# Altium project Game_TEAD_Aliens_64A-2.PrjPcb
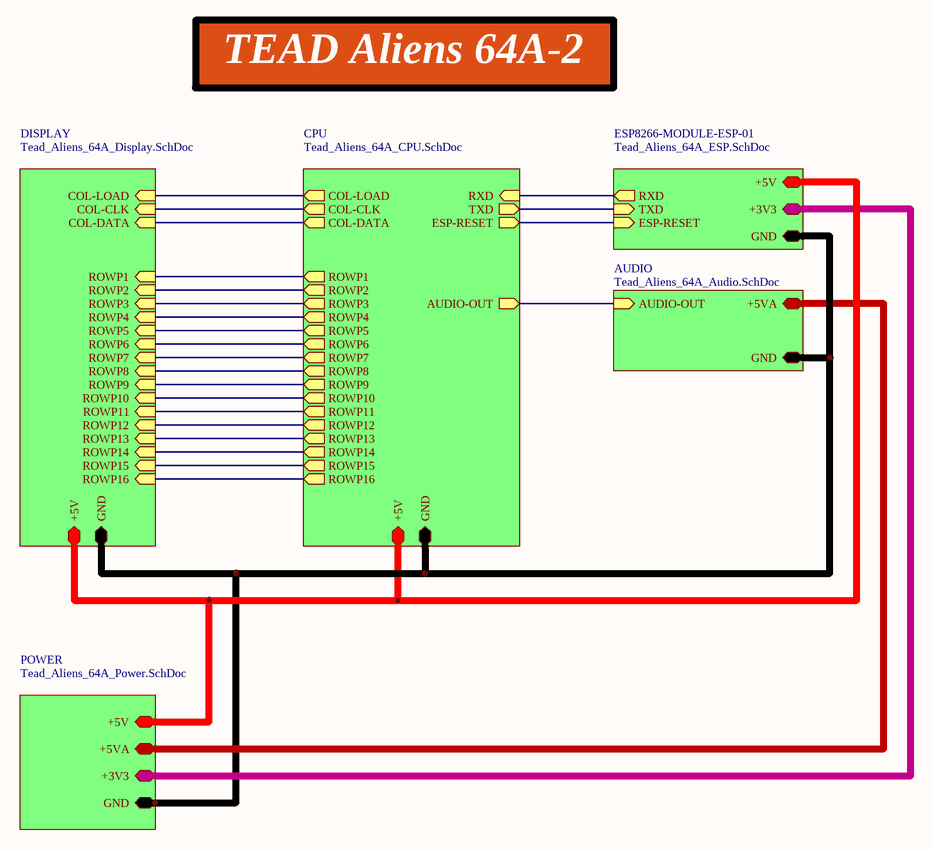
[diagram p0: Tead_Aliens_64A_Main.SchDoc]
6 sheets, 94 parts. Net scope: hierarchical (ports join the sheet entries above them; power ports are global).
Board file: Tead_Aliens_64A.PcbDoc
Sheets:
  Tead_Aliens_64A_Main.SchDoc
    DISPLAY = Tead_Aliens_64A_Display.SchDoc
    CPU = Tead_Aliens_64A_CPU.SchDoc
    ESP8266-MODULE-ESP-01 = Tead_Aliens_64A_ESP.SchDoc
    AUDIO = Tead_Aliens_64A_Audio.SchDoc
    POWER = Tead_Aliens_64A_Power.SchDoc

## Sheet Tead_Aliens_64A_Main.SchDoc: Tead Aliens on ATMega64A(Main)
size A4; Date: 21/01/2021; ApprovedBy: NeperMath; CheckedBy: NeperMath; Author: NeperMath; DrawnBy: NeperMath; Engineer: NeperMath; Address1: Tead Alien Clock; Address2: on ATMega64A; Address3: AVR Risc microcontroller; Address4: displays (8x8) 3x2; DocumentNumber: 1; Revision: 1; SheetNumber: 1; SheetTotal: 1; CurrentTime: 00:57; CurrentDate: 21/01/2021; Time: 00:56

### Sub-sheets
AUDIO = Tead_Aliens_64A_Audio.SchDoc: AUDIO-OUT (in), GND, +5VA
CPU = Tead_Aliens_64A_CPU.SchDoc: COL-LOAD (out), COL-CLK (out), COL-DATA (out), ROWP1 (out), ROWP2 (out), ROWP3 (out), ROWP4 (out), ROWP5 (out), ROWP6 (out), ROWP8 (out), ROWP9 (out), ROWP10 (out), ROWP11 (out), ROWP12 (out), ROWP13 (out), ROWP14 (out), ROWP15 (out), ROWP16 (out), RXD (in), TXD (out), AUDIO-OUT (out), ESP-RESET (out), +5V, GND, ROWP7 (out)
DISPLAY = Tead_Aliens_64A_Display.SchDoc: COL-LOAD (in), COL-CLK (in), COL-DATA (in), ROWP1 (in), ROWP2 (in), ROWP3 (in), ROWP4 (in), ROWP5 (in), ROWP6 (in), ROWP7 (in), ROWP8 (in), ROWP9 (in), ROWP10 (in), ROWP11 (in), ROWP12 (in), ROWP13 (in), ROWP14 (in), ROWP15 (in), ROWP16 (in), +5V, GND
ESP8266-MODULE-ESP-01 = Tead_Aliens_64A_ESP.SchDoc: RXD (out), TXD (in), ESP-RESET (in), +5V, +3V3, GND
POWER = Tead_Aliens_64A_Power.SchDoc: +5V, +5VA, +3V3, GND

### Nets
AIN: sheet CPU/AUDIO-OUT, sheet AUDIO/AUDIO-OUT
COL-C: sheet DISPLAY/COL-CLK, sheet CPU/COL-CLK
COL-D-1-8: sheet DISPLAY/COL-DATA, sheet CPU/COL-DATA
COL-L: sheet DISPLAY/COL-LOAD, sheet CPU/COL-LOAD
ESP-RES: sheet CPU/ESP-RESET, sheet ESP8266-MODULE-ESP-01/ESP-RESET
ROWR1: sheet DISPLAY/ROWP1, sheet CPU/ROWP1
ROWR2: sheet DISPLAY/ROWP2, sheet CPU/ROWP2
ROWR3: sheet DISPLAY/ROWP3, sheet CPU/ROWP3
ROWR4: sheet DISPLAY/ROWP4, sheet CPU/ROWP4
ROWR5: sheet DISPLAY/ROWP5, sheet CPU/ROWP5
ROWR6: sheet DISPLAY/ROWP6, sheet CPU/ROWP6
ROWR7: sheet DISPLAY/ROWP7, sheet CPU/ROWP7
ROWR8: sheet DISPLAY/ROWP8, sheet CPU/ROWP8
ROWR9: sheet DISPLAY/ROWP9, sheet CPU/ROWP9
ROWR10: sheet DISPLAY/ROWP10, sheet CPU/ROWP10
ROWR11: sheet DISPLAY/ROWP11, sheet CPU/ROWP11
ROWR12: sheet DISPLAY/ROWP12, sheet CPU/ROWP12
ROWR13: sheet DISPLAY/ROWP13, sheet CPU/ROWP13
ROWR14: sheet DISPLAY/ROWP14, sheet CPU/ROWP14
ROWR15: sheet DISPLAY/ROWP15, sheet CPU/ROWP15
ROWR16: sheet DISPLAY/ROWP16, sheet CPU/ROWP16
RX: sheet CPU/RXD, sheet ESP8266-MODULE-ESP-01/RXD
TX: sheet CPU/TXD, sheet ESP8266-MODULE-ESP-01/TXD
(unnamed): sheet DISPLAY/+5V, sheet CPU/+5V, sheet ESP8266-MODULE-ESP-01/+5V, sheet POWER/+5V
(unnamed): sheet DISPLAY/GND, sheet CPU/GND, sheet ESP8266-MODULE-ESP-01/GND, sheet AUDIO/GND, sheet POWER/GND
(unnamed): sheet ESP8266-MODULE-ESP-01/+3V3, sheet POWER/+3V3
(unnamed): sheet AUDIO/+5VA, sheet POWER/+5VA

### Notes on the sheet
- TEAD Aliens 64A-2
- Title
- Size:
- Date:
- A4
- Number:
- Time:
- Revision:
- Sheet
- of
- File:

## Sheet Tead_Aliens_64A_Display.SchDoc: Tead Aliens 64A Display
size A4; Date: 23/01/2021; CheckedBy: Nepermath; Author: Nepermath; DrawnBy: Nepermath; Engineer: Nepermath; DocumentNumber: Nepermath; Revision: 1; SheetNumber: 1; SheetTotal: 1; CurrentTime: 14:51; CurrentDate: 23/01/2021; Time: 23:01
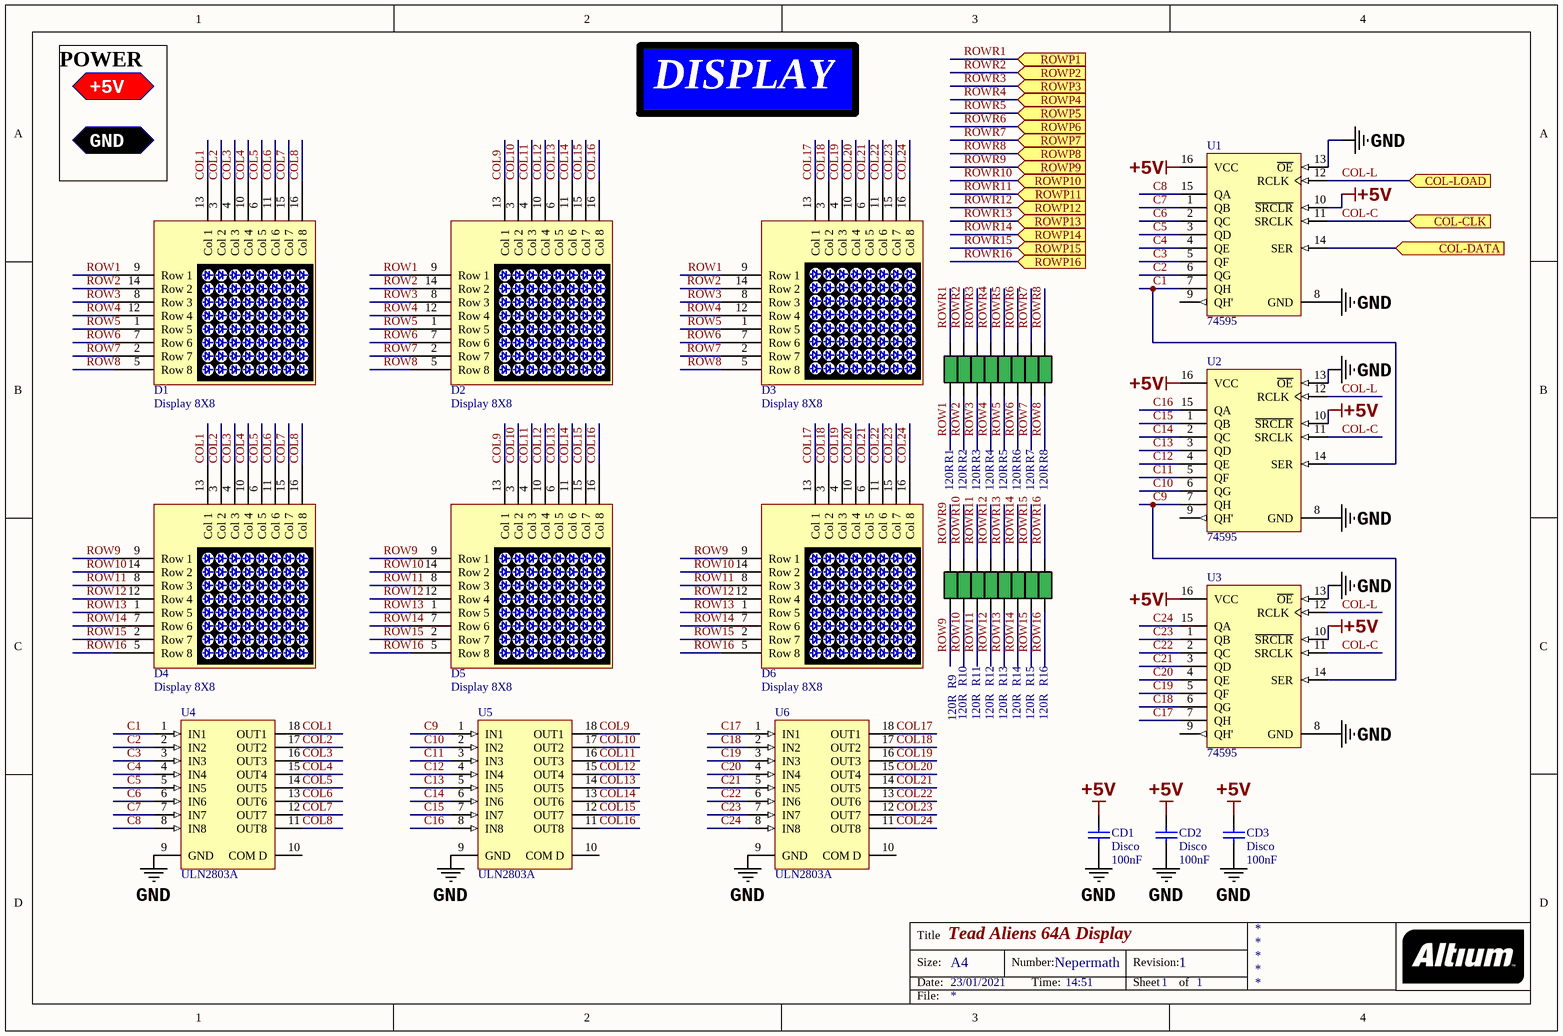
[diagram p1: Tead_Aliens_64A_Display.SchDoc]

### Parts
CD1  Disco  value 100nF  [CAP CER DISK 3MM]
CD2  Disco  value 100nF  [CAP CER DISK 3MM]
CD3  Disco  value 100nF  [CAP CER DISK 3MM]
D1  Display 8X8  [DISPLAY_2088BS_DIP_2X8]
D2  Display 8X8  [DISPLAY_2088BS_DIP_2X8]
D3  Display 8X8  [DISPLAY_2088BS_DIP_2X8]
D4  Display 8X8  [DISPLAY_2088BS_DIP_2X8]
D5  Display 8X8  [DISPLAY_2088BS_DIP_2X8]
D6  Display 8X8  [DISPLAY_2088BS_DIP_2X8]
R1  value 120R  [RES_0805]  (hidden comment: Resistor Generic)
R2  value 120R  [RES_0805]  (hidden comment: Resistor Generic)
R3  value 120R  [RES_0805]  (hidden comment: Resistor Generic)
R4  value 120R  [RES_0805]  (hidden comment: Resistor Generic)
R5  value 120R  [RES_0805]  (hidden comment: Resistor Generic)
R6  value 120R  [RES_0805]  (hidden comment: Resistor Generic)
R7  value 120R  [RES_0805]  (hidden comment: Resistor Generic)
R8  value 120R  [RES_0805]  (hidden comment: Resistor Generic)
R9  value 120R  [RES_0805]  (hidden comment: Resistor Generic)
R10  value 120R  [RES_0805]  (hidden comment: Resistor Generic)
R11  value 120R  [RES_0805]  (hidden comment: Resistor Generic)
R12  value 120R  [RES_0805]  (hidden comment: Resistor Generic)
R13  value 120R  [RES_0805]  (hidden comment: Resistor Generic)
R14  value 120R  [RES_0805]  (hidden comment: Resistor Generic)
R15  value 120R  [RES_0805]  (hidden comment: Resistor Generic)
R16  value 120R  [RES_0805]  (hidden comment: Resistor Generic)
U1  74595  [DIP16]
U2  74595  [DIP16]
U3  74595  [DIP16]
U4  ULN2803A  [DIP18]
U5  ULN2803A  [DIP18]
U6  ULN2803A  [DIP18]

### Ports
+5V, COL-CLK (in), COL-DATA (in), COL-LOAD (in), GND, ROWP1 (in), ROWP2 (in), ROWP3 (in), ROWP4 (in), ROWP5 (in), ROWP6 (in), ROWP7 (in), ROWP8 (in), ROWP9 (in), ROWP10 (in), ROWP11 (in), ROWP12 (in), ROWP13 (in), ROWP14 (in), ROWP15 (in), ROWP16 (in)

### Nets
+5V: CD1.1 CD2.1 CD3.1 U1.10(~{SRCLR}) U1.16(VCC) U2.10(~{SRCLR}) U2.16(VCC) U3.10(~{SRCLR}) U3.16(VCC)
GND: CD1.2 CD2.2 CD3.2 U1.8(GND) U1.13(~{OE}) U2.8(GND) U2.13(~{OE}) U3.8(GND) U3.13(~{OE}) U4.9(GND) U5.9(GND) U6.9(GND)
C1: U1.7(QH) U2.14(SER) U4.1(IN1)
C2: U1.6(QG) U4.2(IN2)
C3: U1.5(QF) U4.3(IN3)
C4: U1.4(QE) U4.4(IN4)
C5: U1.3(QD) U4.5(IN5)
C6: U1.2(QC) U4.6(IN6)
C7: U1.1(QB) U4.7(IN7)
C8: U1.15(QA) U4.8(IN8)
C9: U2.7(QH) U3.14(SER) U5.1(IN1)
C10: U2.6(QG) U5.2(IN2)
C11: U2.5(QF) U5.3(IN3)
C12: U2.4(QE) U5.4(IN4)
C13: U2.3(QD) U5.5(IN5)
C14: U2.2(QC) U5.6(IN6)
C15: U2.1(QB) U5.7(IN7)
C16: U2.15(QA) U5.8(IN8)
C17: U3.7(QH) U6.1(IN1)
C18: U3.6(QG) U6.2(IN2)
C19: U3.5(QF) U6.3(IN3)
C20: U3.4(QE) U6.4(IN4)
C21: U3.3(QD) U6.5(IN5)
C22: U3.2(QC) U6.6(IN6)
C23: U3.1(QB) U6.7(IN7)
C24: U3.15(QA) U6.8(IN8)
COL1: D1.13(Col_1) D4.13(Col_1) U4.18(OUT1)
COL2: D1.3(Col_2) D4.3(Col_2) U4.17(OUT2)
COL3: D1.4(Col_3) D4.4(Col_3) U4.16(OUT3)
COL4: D1.10(Col_4) D4.10(Col_4) U4.15(OUT4)
COL5: D1.6(Col_5) D4.6(Col_5) U4.14(OUT5)
COL6: D1.11(Col_6) D4.11(Col_6) U4.13(OUT6)
COL7: D1.15(Col_7) D4.15(Col_7) U4.12(OUT7)
COL8: D1.16(Col_8) D4.16(Col_8) U4.11(OUT8)
COL9: D2.13(Col_1) D5.13(Col_1) U5.18(OUT1)
COL10: D2.3(Col_2) D5.3(Col_2) U5.17(OUT2)
COL11: D2.4(Col_3) D5.4(Col_3) U5.16(OUT3)
COL12: D2.10(Col_4) D5.10(Col_4) U5.15(OUT4)
COL13: D2.6(Col_5) D5.6(Col_5) U5.14(OUT5)
COL14: D2.11(Col_6) D5.11(Col_6) U5.13(OUT6)
COL15: D2.15(Col_7) D5.15(Col_7) U5.12(OUT7)
COL16: D2.16(Col_8) D5.16(Col_8) U5.11(OUT8)
COL17: D3.13(Col_1) D6.13(Col_1) U6.18(OUT1)
COL18: D3.3(Col_2) D6.3(Col_2) U6.17(OUT2)
COL19: D3.4(Col_3) D6.4(Col_3) U6.16(OUT3)
COL20: D3.10(Col_4) D6.10(Col_4) U6.15(OUT4)
COL21: D3.6(Col_5) D6.6(Col_5) U6.14(OUT5)
COL22: D3.11(Col_6) D6.11(Col_6) U6.13(OUT6)
COL23: D3.15(Col_7) D6.15(Col_7) U6.12(OUT7)
COL24: D3.16(Col_8) D6.16(Col_8) U6.11(OUT8)
COL-C: U1.11(SRCLK) U2.11(SRCLK) U3.11(SRCLK) ; port COL-CLK
COL-D-1-8: U1.14(SER) ; port COL-DATA
COL-L: U1.12(RCLK) U2.12(RCLK) U3.12(RCLK) ; port COL-LOAD
ROW1: D1.9(Row_1) D2.9(Row_1) D3.9(Row_1) R1.1
ROW2: D1.14(Row_2) D2.14(Row_2) D3.14(Row_2) R2.1
ROW3: D1.8(Row_3) D2.8(Row_3) D3.8(Row_3) R3.1
ROW4: D1.12(Row_4) D2.12(Row_4) D3.12(Row_4) R4.1
ROW5: D1.1(Row_5) D2.1(Row_5) D3.1(Row_5) R5.1
ROW6: D1.7(Row_6) D2.7(Row_6) D3.7(Row_6) R6.1
ROW7: D1.2(Row_7) D2.2(Row_7) D3.2(Row_7) R7.1
ROW8: D1.5(Row_8) D2.5(Row_8) D3.5(Row_8) R8.1
ROW9: D4.9(Row_1) D5.9(Row_1) D6.9(Row_1) R9.1
ROW10: D4.14(Row_2) D5.14(Row_2) D6.14(Row_2) R10.1
ROW11: D4.8(Row_3) D5.8(Row_3) D6.8(Row_3) R11.1
ROW12: D4.12(Row_4) D5.12(Row_4) D6.12(Row_4) R12.1
ROW13: D4.1(Row_5) D5.1(Row_5) D6.1(Row_5) R13.1
ROW14: D4.7(Row_6) D5.7(Row_6) D6.7(Row_6) R14.1
ROW15: D4.2(Row_7) D5.2(Row_7) D6.2(Row_7) R15.1
ROW16: D4.5(Row_8) D5.5(Row_8) D6.5(Row_8) R16.1
ROWR1: R1.2 ; port ROWP1
ROWR2: R2.2 ; port ROWP2
ROWR3: R3.2 ; port ROWP3
ROWR4: R4.2 ; port ROWP4
ROWR5: R5.2 ; port ROWP5
ROWR6: R6.2 ; port ROWP6
ROWR7: R7.2 ; port ROWP7
ROWR8: R8.2 ; port ROWP8
ROWR9: R9.2 ; port ROWP9
ROWR10: R10.2 ; port ROWP10
ROWR11: R11.2 ; port ROWP11
ROWR12: R12.2 ; port ROWP12
ROWR13: R13.2 ; port ROWP13
ROWR14: R14.2 ; port ROWP14
ROWR15: R15.2 ; port ROWP15
ROWR16: R16.2 ; port ROWP16

Not connected (* = marked no-connect by the designer): U1 9(QH'); U2 9(QH'); U3 9(QH'); U4 10(COM_D); U5 10(COM_D); U6 10(COM_D)

### Notes on the sheet
- DISPLAY
- (near D1) POWER
- Title
- Size:
- Date:
- A4
- Number:
- Time:
- Revision:
- Sheet
- of
- File:

### Library data of the parts
CD1-CD3 = CAP_DISCO: SMD Capacitor 1210 size
D1-D6 = Display 2088BS 8x8 60mm X 60 mm: Display Dot LED 8x8  60mm X 60 mm
R1-R16 = Resistor Generic: Generic Resistor
U1-U3 = 74595 Generico L,H,HC,F,LS: 74595 Generico L,H,LC,HC,F,LS
U4-U6 = ULN2803A: Eight Darlington Array; Published: 8-Jun-2000; LatestRevisionDate: 06-Jun-2005; LatestRevisionNote: Stylized 3D Model Added.; DatasheetVersion: Sep-1997; PackageReference: DIP18; Publisher: Altium Limited; PackageDescription: DIP; 18 Leads; Row Spacing 7.62 mm; Pitch 2.54 mm; ComponentLink1Description: Manufacturer Link; ComponentLink1URL: http://www.st.com/; ComponentLink2Description: Datasheet; ComponentLink2URL: http://www.st.com/stonline/products/literature/ds/1536/uln2801a.pdf

## Sheet Tead_Aliens_64A_CPU.SchDoc: Tead Aliens 64A CPU
size A4; Date: 23/01/2021; ApprovedBy: NeperMath; CheckedBy: NeperMath; Author: NeperMath; DrawnBy: NeperMath; Engineer: NeperMath; DocumentNumber: 1; Revision: 1; SheetNumber: 1; SheetTotal: 1; CurrentTime: 15:44; CurrentDate: 23/01/2021; Time: 15:44
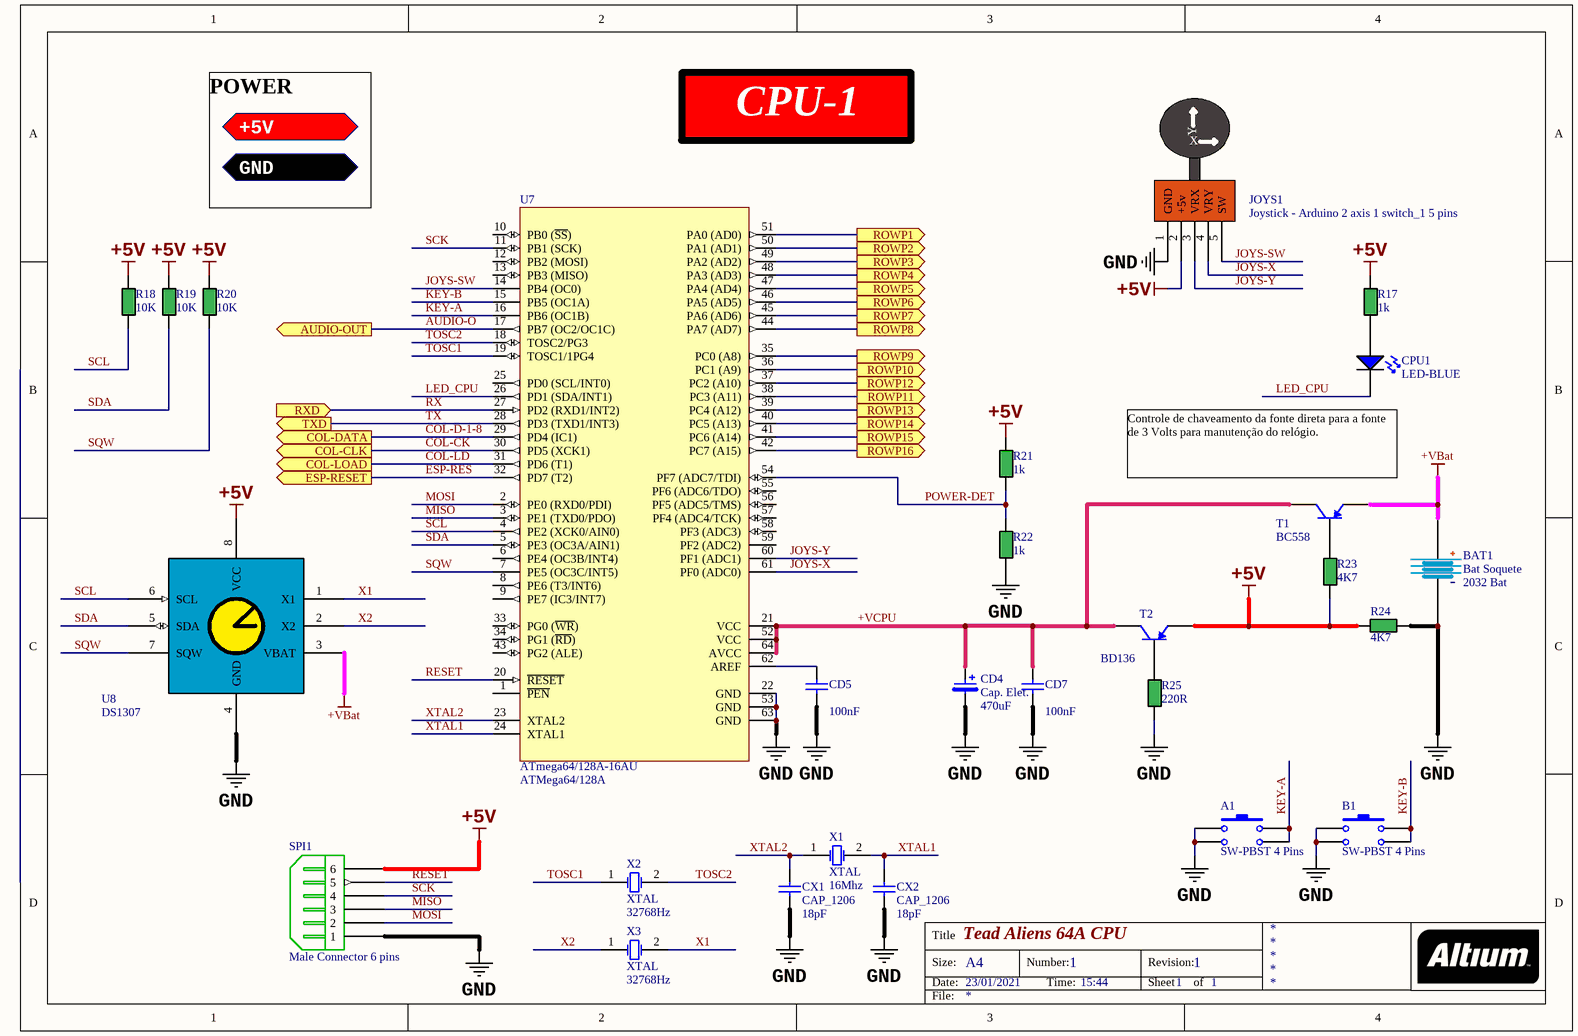
[diagram p2: Tead_Aliens_64A_CPU.SchDoc]

### Parts
A1  SW-PBST 4 Pins  [SW-PBST 4 PINS - B3F]
B1  SW-PBST 4 Pins  [SW-PBST 4 PINS - B3F]
BAT1  Bat Soquete  value 2032 Bat  [Batt Sup CR2025]
CD4  Cap. Elet.  value 470uF  [CAP ELE RAD 11mm H]
CD5  value 100nF  [CAP_1206]  (hidden comment: CAP_1206)
CD7  value 100nF  [CAP_1206]  (hidden comment: CAP_1206)
CPU1  LED-BLUE  [LED BLUE 3MM]
CX1  CAP_1206  value 18pF  [CAP_1206]
CX2  CAP_1206  value 18pF  [CAP_1206]
JOYS1  Joystick - Arduino 2 axis 1 switch_1 5 pins  [JOYSTICK ARDUINO 5 PINS 0 GRAUS]
R17  value 1k  [RES_0805]  (hidden comment: Resistor Generic)
R18  value 10K  [RES_0805]  (hidden comment: Resistor Generic)
R19  value 10K  [RES_0805]  (hidden comment: Resistor Generic)
R20  value 10K  [RES_0805]  (hidden comment: Resistor Generic)
R21  value 1k  [RES_0805]  (hidden comment: Resistor Generic)
R22  value 1k  [RES_0805]  (hidden comment: Resistor Generic)
R23  value 4K7  [RES_0805]  (hidden comment: Resistor Generic)
R24  value 4K7  [RES_0805]  (hidden comment: Resistor Generic)
R25  value 220R  [RES 300 CR25]  (hidden comment: Resistor Generic)
SPI1  Male Connector 6 pins  [BPSC-6]
T1  value BC558  [TO-92 - BIG]  (hidden comment: Transistor)
T2  value BD136  [TO126]  (hidden comment: Transistor)
U7  ATmega64/128A-16AU  value ATMega64/128A  [64A_L]
U8  DS1307  [DIP8]
X1  XTAL  value 16Mhz  [XTAL HC49-4H]
X2  XTAL  value 32768Hz  [XTAL CILINDRIC DEITADO]
X3  XTAL  value 32768Hz  [XTAL CILINDRIC DEITADO]

### Ports
+5V, AUDIO-OUT (out), COL-CLK (out), COL-DATA (out), COL-LOAD (out), ESP-RESET (out), GND, ROWP1 (out), ROWP2 (out), ROWP3 (out), ROWP4 (out), ROWP5 (out), ROWP6 (out), ROWP7 (out), ROWP8 (out), ROWP9 (out), ROWP10 (out), ROWP11 (out), ROWP12 (out), ROWP13 (out), ROWP14 (out), ROWP15 (out), ROWP16 (out), RXD (in), TXD (out)

### Nets
+5V: JOYS1.2(+5v) R17.2 R18.2 R19.2 R20.2 R21.2 R23.1 R24.2 SPI1.6 T2.1(E) U8.8(VCC)
+VBat: BAT1.1 T1.1(E) U8.3(VBAT)
GND: A1.1 A1.2 B1.1 B1.2 BAT1.2 CD4.2 CD5.1 CD7.1 CX1.1 CX2.1 JOYS1.1(GND) R22.1 R24.1 R25.1 SPI1.1 U7.22(GND) U7.53(GND) U7.63(GND) U8.4(GND)
+VCPU: CD4.1 CD7.2 T1.3(C) T2.3(C) U7.21(VCC) U7.52(VCC) U7.64(AVCC)
AUDIO-O: U7.17(PB7_(OC2/OC1C)) ; port AUDIO-OUT  [project net AIN]
COL-CK: U7.30(PD5_(XCK1)) ; port COL-CLK  [project net COL-C]
COL-D-1-8: U7.29(PD4_(IC1)) ; port COL-DATA
COL-LD: U7.31(PD6_(T1)) ; port COL-LOAD  [project net COL-L]
ESP-RES: U7.32(PD7_(T2)) ; port ESP-RESET
JOYS-SW: JOYS1.5(SW) U7.14(PB4_(OC0))
JOYS-X: JOYS1.4(VRY) U7.61(PF0_(ADC0))
JOYS-Y: JOYS1.3(VRX) U7.60(PF1_(ADC1))
KEY-A: A1.3 A1.4 U7.16(PB6_(OC1B))
KEY-B: B1.3 B1.4 U7.15(PB5_(OC1A))
LED_CPU: CPU1.K U7.26(PD1_(SDA/INT1))
MISO: SPI1.3 U7.3(PE1_(TXD0/PDO))
MOSI: SPI1.2 U7.2(PE0_(RXD0/PDI))
POWER-DET: R21.1 R22.2 U7.54(PF7_(ADC7/TDI))
RESET: SPI1.5 U7.20(~{RESET})
ROWR1: U7.51(PA0_(AD0)) ; port ROWP1
ROWR2: U7.50(PA1_(AD1)) ; port ROWP2
ROWR3: U7.49(PA2_(AD2)) ; port ROWP3
ROWR4: U7.48(PA3_(AD3)) ; port ROWP4
ROWR5: U7.47(PA4_(AD4)) ; port ROWP5
ROWR6: U7.46(PA5_(AD5)) ; port ROWP6
ROWR7: U7.45(PA6_(AD6)) ; port ROWP7
ROWR8: U7.44(PA7_(AD7)) ; port ROWP8
ROWR9: U7.35(PC0_(A8)) ; port ROWP9
ROWR10: U7.36(PC1_(A9)) ; port ROWP10
ROWR11: U7.38(PC3_(A11)) ; port ROWP11
ROWR12: U7.37(PC2_(A10)) ; port ROWP12
ROWR13: U7.39(PC4_(A12)) ; port ROWP13
ROWR14: U7.40(PC5_(A13)) ; port ROWP14
ROWR15: U7.41(PC6_(A14)) ; port ROWP15
ROWR16: U7.42(PC7_(A15)) ; port ROWP16
RX: U7.27(PD2_(RXD1/INT2)) ; port RXD
SCK: SPI1.4 U7.11(PB1_(SCK))
SCL: R18.1 U7.4(PE2_(XCK0/AIN0)) U8.6(SCL)
SDA: R19.1 U7.5(PE3_(OC3A/AIN1)) U8.5(SDA)
SQW: R20.1 U7.7(PE5_(OC3C/INT5)) U8.7(SQW)
TOSC1: U7.19(TOSC1/1PG4) X2.1(OSC1)
TOSC2: U7.18(TOSC2/PG3) X2.2(OSC2)
TX: U7.28(PD3_(TXD1/INT3)) ; port TXD
X1: U8.1(X1) X3.2(OSC2)
X2: U8.2(X2) X3.1(OSC1)
XTAL1: CX2.2 U7.24(XTAL1) X1.2(OSC2)
XTAL2: CX1.2 U7.23(XTAL2) X1.1(OSC1)
NetCD5_2: CD5.2 U7.62(AREF)
NetCPU1_A: CPU1.A R17.1
NetR23_2: R23.2 T1.2(B)
NetR25_2: R25.2 T2.2(B)

Not connected (* = marked no-connect by the designer): U7 1(~{PEN}) 6(PE4_(OC3B/INT4)) 8(PE6_(T3/INT6)) 9(PE7_(IC3/INT7)) 10(PB0_(~{SS})) 12(PB2_(MOSI)) 13(PB3_(MISO)) 25(PD0_(SCL/INT0)) 33(PG0_(~{WR})) 34(PG1_(~{RD})) 43(PG2_(ALE)) 55(PF6_(ADC6/TDO)) 56(PF5_(ADC5/TMS)) 57(PF4_(ADC4/TCK)) 58(PF3_(ADC3)) 59(PF2_(ADC2))

### Notes on the sheet
- CPU-1
- POWER
- Controle de chaveamento da fonte direta para a fonte de 3 Volts para manutenção do relógio.
- Title
- Size:
- Date:
- A4
- Number:
- Time:
- Revision:
- Sheet
- of
- File:
- (in symbol Joystick - Arduino 2 axis 1 switch_1 5 pins) Y; X

### Library data of the parts
A1 B1 = SW-PBST 4 Pins SKHH: Published: 24-Mar-1999; LatestRevisionDate: 17-Jul-2002; LatestRevisionNote: Re-released for DXP Platform.; PackageReference: SPST-2; Publisher: Altium Limited
BAT1 = Bat 3.6v
CD4 = CAP_RADIAL_ELETROLITICO: Capacitor Radial Eletrolitico
CD5 CD7 CX1 CX2 = CAP_1206: SMD Capacitor 1206 size
CPU1 = LED-BLUE: LED BLUE
JOYS1 = Joystick - Arduino 2 axis 1 switch_1 5 pins: Arduino Joystick 2 axis 1 switch 5 pins
R17-R25 = Resistor Generic: Generic Resistor
SPI1 = Male Con 6 Pin
T1 T2 = T-PNP: General Bipolar Transistor NPN
U7 = ATmega128A-16AU: 8-Bit AVR Microcontroller with 128K Bytes of In-System Programmable Flash Memory; Published: 17-Sep-2003; LatestRevisionDate: 13-Apr-2006; LatestRevisionNote: IPC-7351 Footprint Added.; DatasheetVersion: 2467G-AVR-09/02; PackageVersion: revB, Oct-2001; PackageReference: 64A; Publisher: Altium Limited; PackageDescription: 64-Pin Thin Quad Flat Pack 0.8 mm Pitch; Code_JEDEC: MS-026-AEB; ComponentLink1Description: Manufacturer Link; ComponentLink1URL: http://www.atmel.com; ComponentLink2Description: Datasheet; ComponentLink2URL: http://www.atmel.com/dyn/resources/prod_documents/doc2467.pdf
U8 = RTC: Real Time Clock
X1-X3 = XTAL: Crystal Oscillator

## Sheet Tead_Aliens_64A_ESP.SchDoc: Tead Aliens 64A ESP8266
size A4; Date: 27/01/2021; ApprovedBy: NeperMath; CheckedBy: NeperMath; Author: NeperMath; DrawnBy: NeperMath; Engineer: NeperMath; DocumentNumber: 1; Revision: 1; SheetNumber: 1; SheetTotal: 1; CurrentTime: 19:35; CurrentDate: 27/01/2021; Time: 19:34
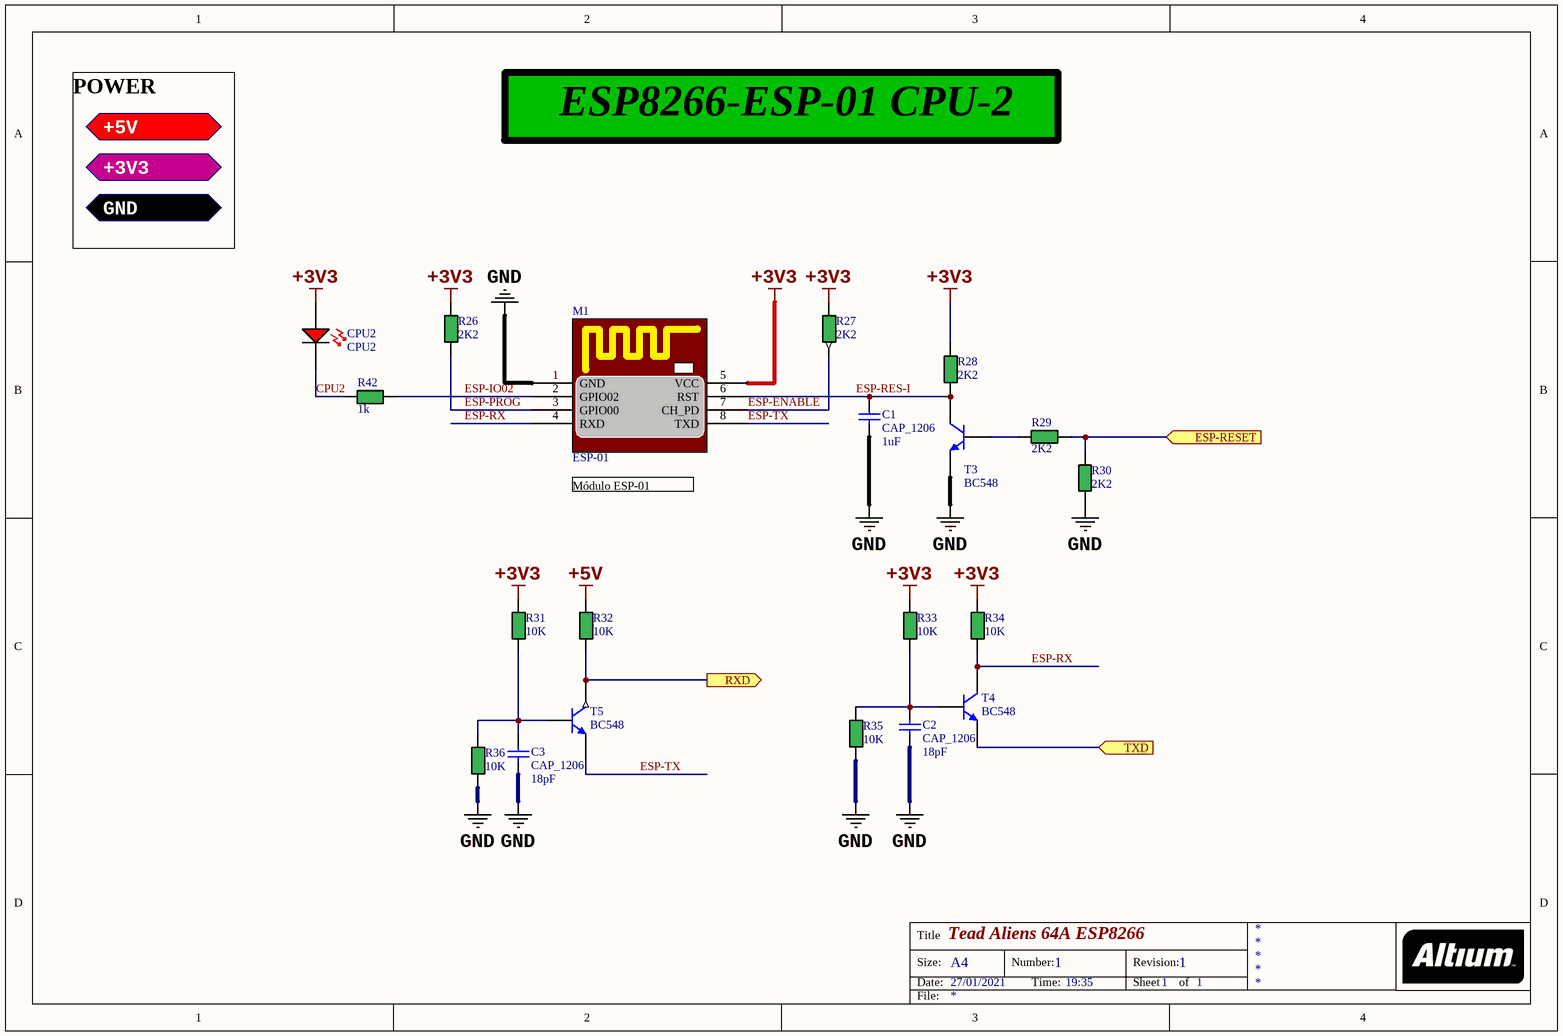
[diagram p3: Tead_Aliens_64A_ESP.SchDoc]

### Parts
C1  CAP_1206  value 1uF  [CAP_1206]
C2  CAP_1206  value 18pF  [CAP_1206]
C3  CAP_1206  value 18pF  [CAP_1206]
CPU2  CPU2  [LED Red 3mm]
M1  ESP-01  [ESP-8266-ESP-01]
R26  value 2K2  [RES_0805]  (hidden comment: Resistor Generic)
R27  value 2K2  [RES_0805]  (hidden comment: Resistor Generic)
R28  value 2K2  [RES_0805]  (hidden comment: Resistor Generic)
R29  value 2K2  [RES_0805]  (hidden comment: Resistor Generic)
R30  value 2K2  [RES_0805]  (hidden comment: Resistor Generic)
R31  value 10K  [RES_0805]  (hidden comment: Resistor Generic)
R32  value 10K  [RES_0805]  (hidden comment: Resistor Generic)
R33  value 10K  [RES_0805]  (hidden comment: Resistor Generic)
R34  value 10K  [RES_0805]  (hidden comment: Resistor Generic)
R35  value 10K  [RES_0805]  (hidden comment: Resistor Generic)
R36  value 10K  [RES_0805]  (hidden comment: Resistor Generic)
R42  value 1k  [RES_0805]  (hidden comment: Resistor Generic)
T3  value BC548  [TO-92 - BIG]  (hidden comment: Transistor)
T4  value BC548  [TO-92 - BIG]  (hidden comment: Transistor)
T5  value BC548  [TO-92 - BIG]  (hidden comment: Transistor)

### Ports
+3V3, +5V, ESP-RESET (in), GND, RXD (out), TXD (in)

### Nets
+3V3: CPU2.A M1.5(VCC) R26.2 R27.2 R28.2 R31.2 R33.2 R34.2
+5V: R32.2
GND: C1.1 C2.1 C3.1 M1.1(GND) R30.2 R35.1 R36.1 T3.1(E)
CPU2: CPU2.K R42.1
ESP-ENABLE: M1.7(CH_PD) R27.1
ESP-IO02: M1.2(GPIO02) R42.2
ESP-PROG: M1.3(GPIO00) R26.1
ESP-RES: R29.1 R30.1 ; port ESP-RESET
ESP-RES-I: C1.2 M1.6(RST) R28.1 T3.3(C)
ESP-RX: M1.4(RXD) R34.1 T4.3(C)
ESP-TX: M1.8(TXD) T5.1(E)
RX: R32.1 T5.3(C) ; port RXD
TX: T4.1(E) ; port TXD
NetC2_2: C2.2 R33.1 R35.2 T4.2(B)
NetC3_2: C3.2 R31.1 R36.2 T5.2(B)
NetR29_2: R29.2 T3.2(B)

### Notes on the sheet
- ESP8266-ESP-01 CPU-2
- POWER
- Módulo ESP-01
- Title
- Size:
- Date:
- A4
- Number:
- Time:
- Revision:
- Sheet
- of
- File:

### Library data of the parts
C1-C3 = CAP_1206: SMD Capacitor 1206 size
CPU2 = LED-RED: LED RED
M1 = ESP-01 Module: ESP8266 ESP-01 Module
R26-R36 R42 = Resistor Generic: Generic Resistor
T3-T5 = T-NPN: General Bipolar Transistor NPN

## Sheet Tead_Aliens_64A_Audio.SchDoc: Tead Aliens 64A Audio
size A4; Date: 27/01/2021; ApprovedBy: NeperMath; CheckedBy: NeperMath; Author: NeperMath; DrawnBy: NeperMath; Engineer: NeperMath; DocumentNumber: 1; SheetNumber: 1; SheetTotal: 1; CurrentTime: 20:24; CurrentDate: 27/01/2021; Time: 20:23
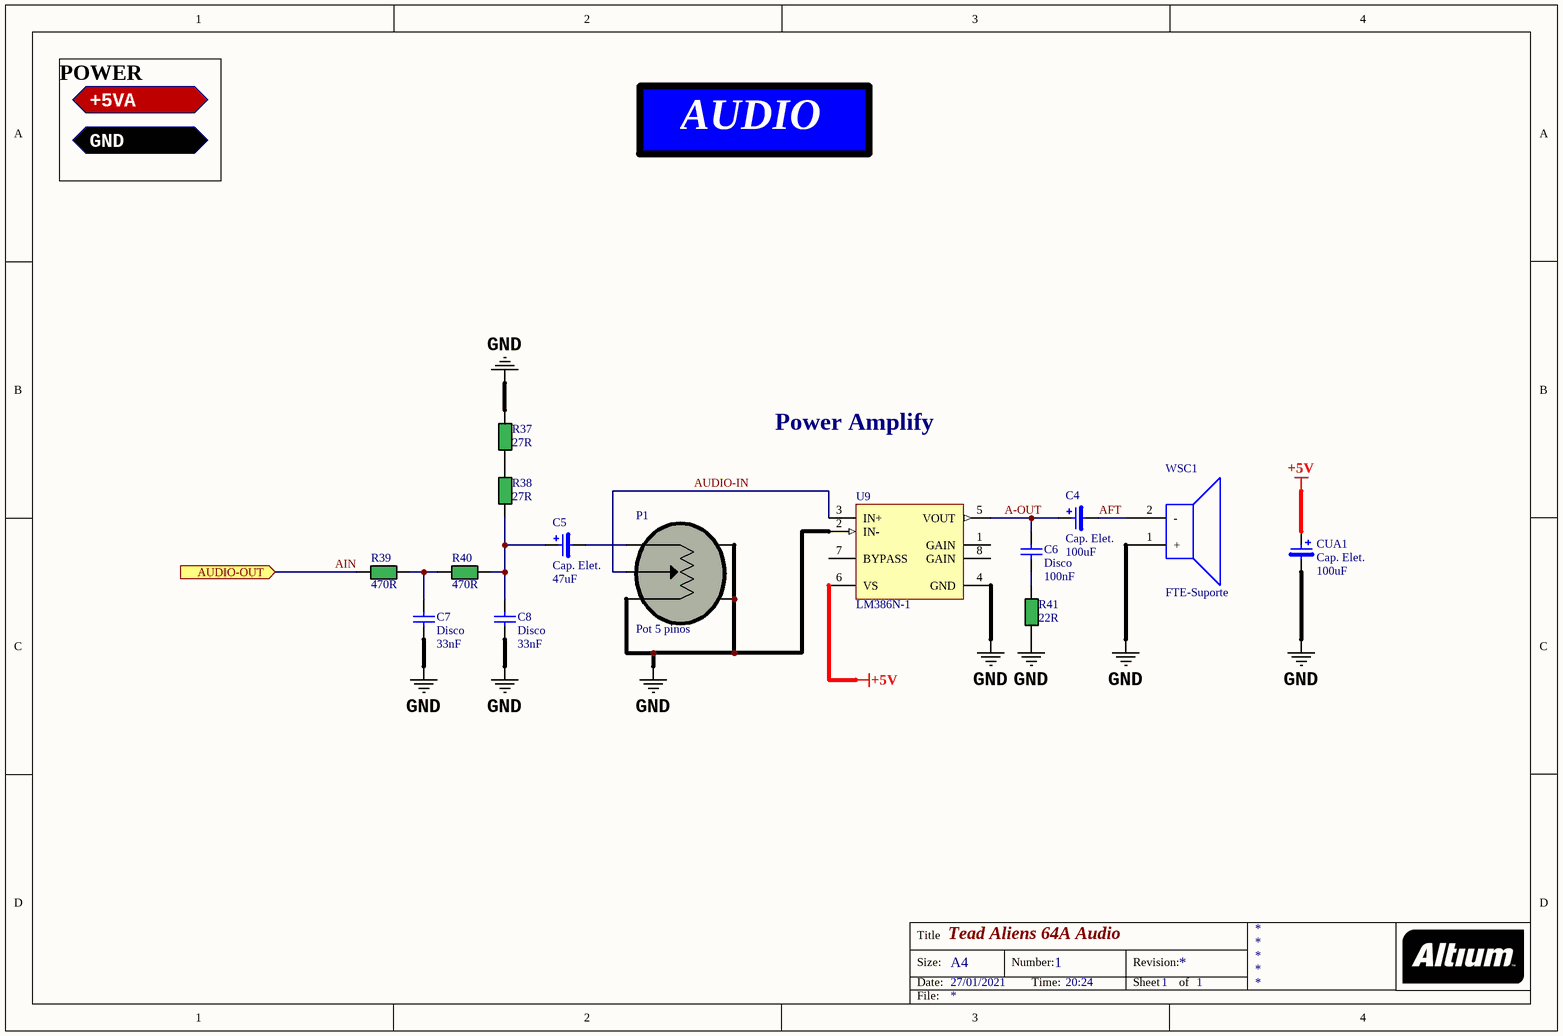
[diagram p4: Tead_Aliens_64A_Audio.SchDoc]

### Parts
C4  Cap. Elet.  value 100uF  [CAP_RADIAL_2_10_16]
C5  Cap. Elet.  value 47uF  [CAP ELE RAD 11mm H]
C6  Disco  value 100nF  [CAP CER DISK 3MM]
C7  Disco  value 33nF  [CAP CER DISK 3MM]
C8  Disco  value 33nF  [CAP CER DISK 3MM]
CUA1  Cap. Elet.  value 100uF  [CAP_RADIAL_2_10_16]
P1  Pot 5 pinos  [POT CHINA MICRO]
R37  value 27R  [RES_0805]  (hidden comment: Resistor Generic)
R38  value 27R  [RES_0805]  (hidden comment: Resistor Generic)
R39  value 470R  [RES_0805]  (hidden comment: Resistor Generic)
R40  value 470R  [RES_0805]  (hidden comment: Resistor Generic)
R41  value 22R  [RES 300 CR25]  (hidden comment: Resistor Generic)
U9  LM386N-1  [DIP8]
WSC1  FTE-Suporte  [FTE-WBC-8OHM-1W-23mm]

### Ports
+5VA, AUDIO-OUT (in), GND

### Nets
+5V: CUA1.1 U9.6(VS)
GND: C7.1 C8.1 CUA1.2 P1.3 P1.4 P1.5 R37.2 R41.1 U9.2(IN-) U9.4(GND) WSC1.1(+)
A-OUT: C4.1 C6.2 U9.5(VOUT)
AFT: C4.2 WSC1.2(-)
AIN: R39.1 ; port AUDIO-OUT
AUDIO-IN: P1.2 U9.3(IN+)
NetC5_1: C5.1 C8.2 R38.1 R40.2
NetC5_2: C5.2 P1.1
NetC6_1: C6.1 R41.2
NetC7_2: C7.2 R39.2 R40.1
NetR37_1: R37.1 R38.2

Not connected (* = marked no-connect by the designer): U9 1(GAIN) 7(BYPASS) 8(GAIN)

### Notes on the sheet
- POWER
- AUDIO
- Power Amplify
- Title
- Size:
- Date:
- A4
- Number:
- Time:
- Revision:
- Sheet
- of
- File:

### Library data of the parts
C4 C5 CUA1 = CAP_RADIAL_ELETROLITICO: Capacitor Radial Eletrolitico
C6-C8 = CAP_DISCO: SMD Capacitor 1210 size
P1 = POT 5 pinos china: Potenciometer 5 pins
R37-R41 = Resistor Generic: Generic Resistor
U9 = LM386N-1: Low Voltage Audio Power Amplifier; Manufacturer: National Semiconductor; CompType: Audio IC; PackageTopMarking: NSUZXYTT*LM*386N-1; Published: 4-Dec-2008; DatasheetVersion: Aug-2000; PackageVersion: revG, May-2006; PackageReference: N08E; PackageDescription: MDIP, .365 x .250 x .130in, 8 Lead, .100in Pitch; PartNumber: LM386N-1; RoHS: O; PinCount: 8; DigiKeyPartNumber: LM386N-1-ND; Code_JEDEC: MS-001-BA; ComponentLink1Description: LM386 Datasheet; ComponentLink1URL: http://www.national.com/ds/LM/LM386.pdf; ComponentLink2Description: LM386 Web Page; ComponentLink2URL: http://www.national.com/pf/LM/LM386.html; ComponentLink3Description: N08E Package Page; ComponentLink3URL: http://www.national.com/packaging/folders/n08e.html
WSC1 = FTE-WBC 8 OHM 23mm X 4.5mm: FTE-WBC-8 OHM 23mm X 4.5mm

## Sheet Tead_Aliens_64A_Power.SchDoc: Tead Aliens 64A Power
size A4; Date: 27/01/2021; CheckedBy: NeperMath; Author: NeperMath; DrawnBy: NeperMath; Engineer: NeperMath; DocumentNumber: 1; Revision: 1; SheetNumber: 1; SheetTotal: 1; CurrentTime: 23:12; CurrentDate: 27/01/2021; Time: 23:12
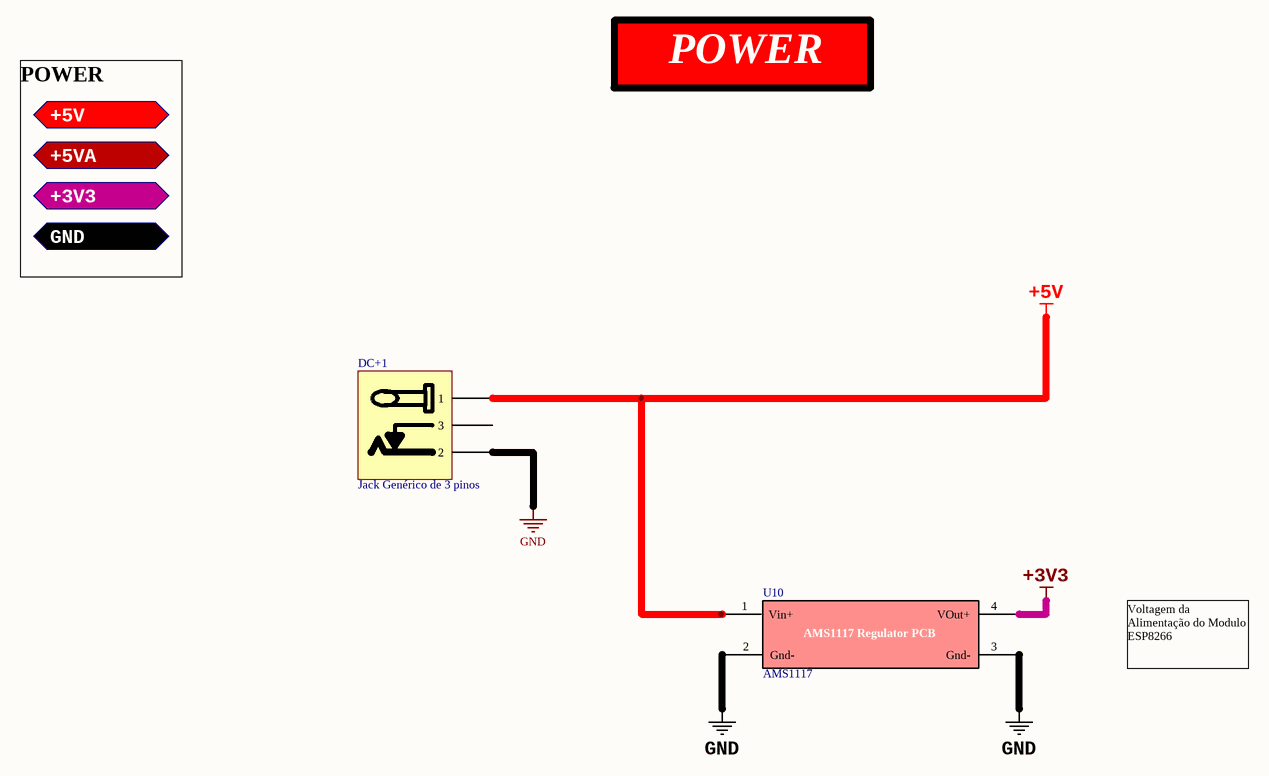
[diagram p5: Tead_Aliens_64A_Power.SchDoc]

### Parts
DC+1  Jack Genérico de 3 pinos  [Jack P4]
U10  AMS1117  [ANS1117_Reg_Pcb]

### Ports
+3V3, +5V, +5VA, GND

### Nets
+3V3: U10.4(VOut+)
+5V: DC+1.1 U10.1(Vin+)
GND: DC+1.2 U10.2(Gnd-) U10.3(Gnd-)

Not connected (* = marked no-connect by the designer): DC+1 3

### Notes on the sheet
- POWER
- Voltagem da Alimentação do Modulo ESP8266
- Title
- Size:
- Date:
- A4
- Number:
- Time:
- Revision:
- Sheet
- of
- File:
- (in symbol AMS1117) AMS1117 Regulator PCB

### Library data of the parts
U10 = AMS1117: AMS1117 REGULATOR PCB

## Nets that join several sheets
+3V3: Tead_Aliens_64A_ESP (8 pins), Tead_Aliens_64A_Power (U10.4)
+5V: Tead_Aliens_64A_Display (9 pins), Tead_Aliens_64A_CPU (11 pins), Tead_Aliens_64A_ESP (R32.2), Tead_Aliens_64A_Audio (CUA1.1 U9.6), Tead_Aliens_64A_Power (DC+1.1 U10.1)
GND: Tead_Aliens_64A_Display (12 pins), Tead_Aliens_64A_CPU (19 pins), Tead_Aliens_64A_ESP (8 pins), Tead_Aliens_64A_Audio (11 pins), Tead_Aliens_64A_Power (DC+1.2 U10.2 U10.3)
AIN: Tead_Aliens_64A_CPU (U7.17), Tead_Aliens_64A_Audio (R39.1)
COL-C: Tead_Aliens_64A_Display (U1.11 U2.11 U3.11), Tead_Aliens_64A_CPU (U7.30)
COL-D-1-8: Tead_Aliens_64A_Display (U1.14), Tead_Aliens_64A_CPU (U7.29)
COL-L: Tead_Aliens_64A_Display (U1.12 U2.12 U3.12), Tead_Aliens_64A_CPU (U7.31)
ESP-RES: Tead_Aliens_64A_CPU (U7.32), Tead_Aliens_64A_ESP (R29.1 R30.1)
ROWR1: Tead_Aliens_64A_Display (R1.2), Tead_Aliens_64A_CPU (U7.51)
ROWR2: Tead_Aliens_64A_Display (R2.2), Tead_Aliens_64A_CPU (U7.50)
ROWR3: Tead_Aliens_64A_Display (R3.2), Tead_Aliens_64A_CPU (U7.49)
ROWR4: Tead_Aliens_64A_Display (R4.2), Tead_Aliens_64A_CPU (U7.48)
ROWR5: Tead_Aliens_64A_Display (R5.2), Tead_Aliens_64A_CPU (U7.47)
ROWR6: Tead_Aliens_64A_Display (R6.2), Tead_Aliens_64A_CPU (U7.46)
ROWR7: Tead_Aliens_64A_Display (R7.2), Tead_Aliens_64A_CPU (U7.45)
ROWR8: Tead_Aliens_64A_Display (R8.2), Tead_Aliens_64A_CPU (U7.44)
ROWR9: Tead_Aliens_64A_Display (R9.2), Tead_Aliens_64A_CPU (U7.35)
ROWR10: Tead_Aliens_64A_Display (R10.2), Tead_Aliens_64A_CPU (U7.36)
ROWR11: Tead_Aliens_64A_Display (R11.2), Tead_Aliens_64A_CPU (U7.38)
ROWR12: Tead_Aliens_64A_Display (R12.2), Tead_Aliens_64A_CPU (U7.37)
ROWR13: Tead_Aliens_64A_Display (R13.2), Tead_Aliens_64A_CPU (U7.39)
ROWR14: Tead_Aliens_64A_Display (R14.2), Tead_Aliens_64A_CPU (U7.40)
ROWR15: Tead_Aliens_64A_Display (R15.2), Tead_Aliens_64A_CPU (U7.41)
ROWR16: Tead_Aliens_64A_Display (R16.2), Tead_Aliens_64A_CPU (U7.42)
RX: Tead_Aliens_64A_CPU (U7.27), Tead_Aliens_64A_ESP (R32.1 T5.3)
TX: Tead_Aliens_64A_CPU (U7.28), Tead_Aliens_64A_ESP (T4.1)